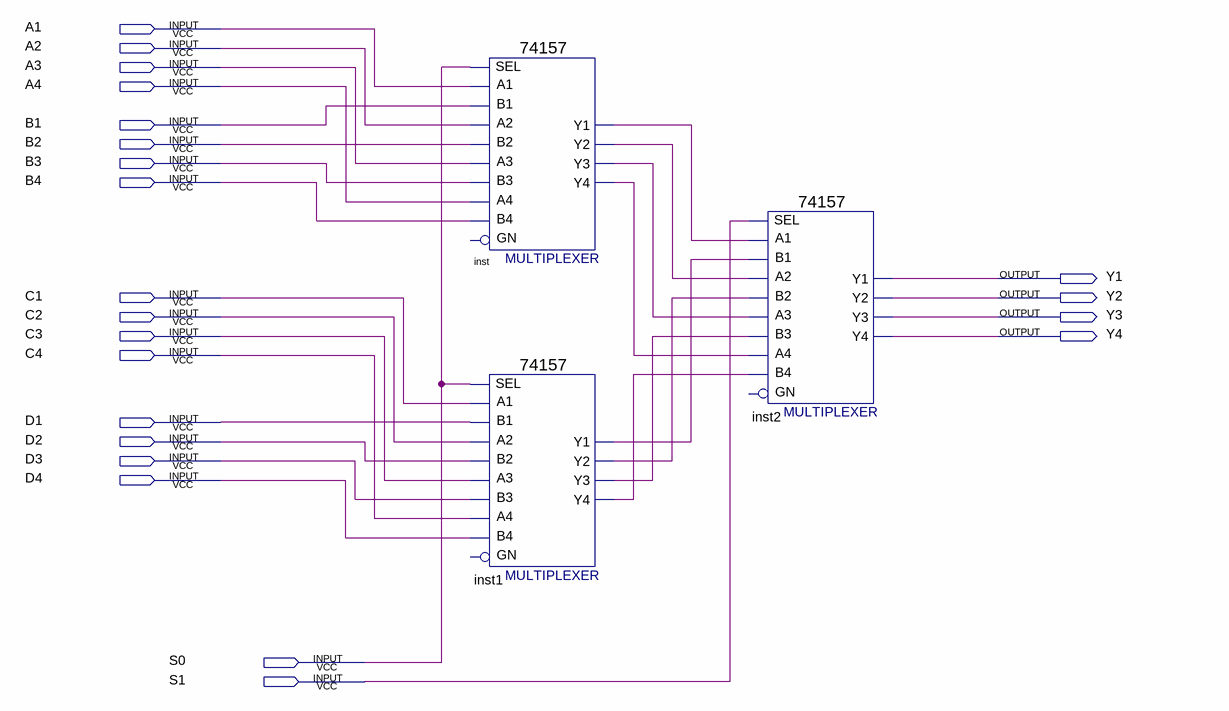
[diagram p0: schematic sheet]
// Quartus schematic multiplexador16x4.bdf as structural Verilog: 3 symbols, 22 pins
module multiplexador16x4 (
  input  A1,
  input  A2,
  input  A3,
  input  A4,
  input  B1,
  input  B2,
  input  B3,
  input  B4,
  input  C1,
  input  C2,
  input  C3,
  input  C4,
  input  D1,
  input  D2,
  input  D3,
  input  D4,
  input  S0,
  input  S1,
  output Y1,
  output Y2,
  output Y3,
  output Y4
);

  wire inst1_y1, inst1_y2, inst1_y3, inst1_y4, inst_y1, inst_y2, inst_y3, inst_y4;

  \74157  inst (
    .A1(A1), .B1(B1), .SEL(S0), .B2(B2), .A3(A3), .B3(B3), .A2(A2), .B4(B4), .A4(A4), .Y2(inst_y2),
    .Y1(inst_y1), .Y4(inst_y4), .Y3(inst_y3));  // open: GN
  \74157  inst1 (
    .A1(C1), .B1(D1), .SEL(S0), .B2(D2), .A3(C3), .B3(D3), .A2(C2), .B4(D4), .A4(C4), .Y2(inst1_y2),
    .Y1(inst1_y1), .Y4(inst1_y4), .Y3(inst1_y3));  // open: GN
  \74157  inst2 (
    .A1(inst_y1), .B1(inst1_y1), .SEL(S1), .B2(inst1_y2), .A3(inst_y3), .B3(inst1_y3), .A2(inst_y2),
    .B4(inst1_y4), .A4(inst_y4), .Y2(Y2), .Y1(Y1), .Y4(Y4), .Y3(Y3));  // open: GN
endmodule
